# EAGLE design daGloane (EAGLE 6.1)
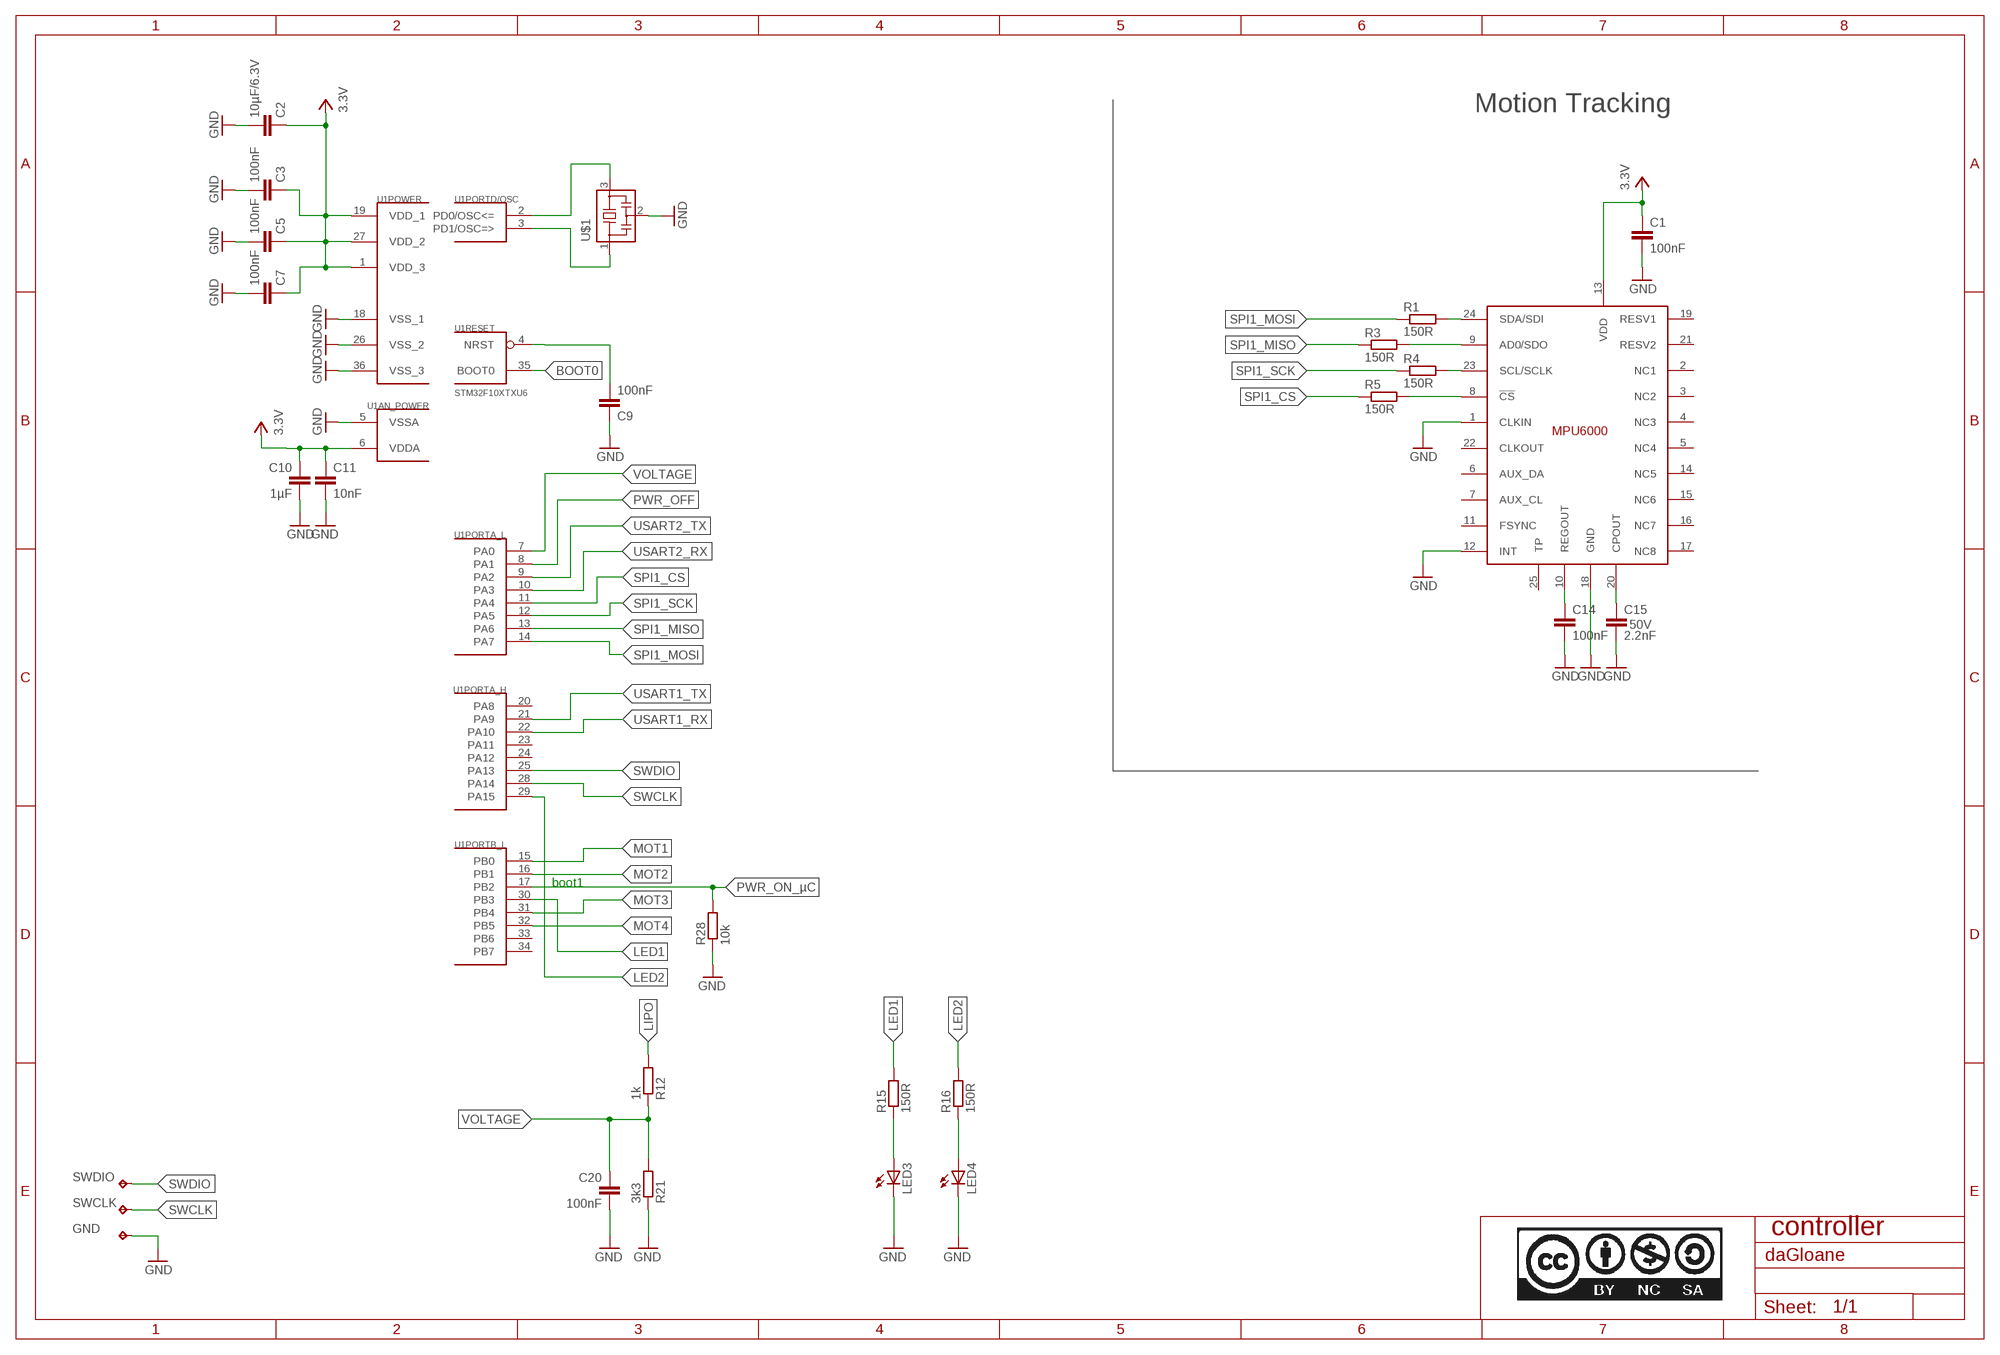
[diagram p0: schematic, sheet 1, part 1 of 3]
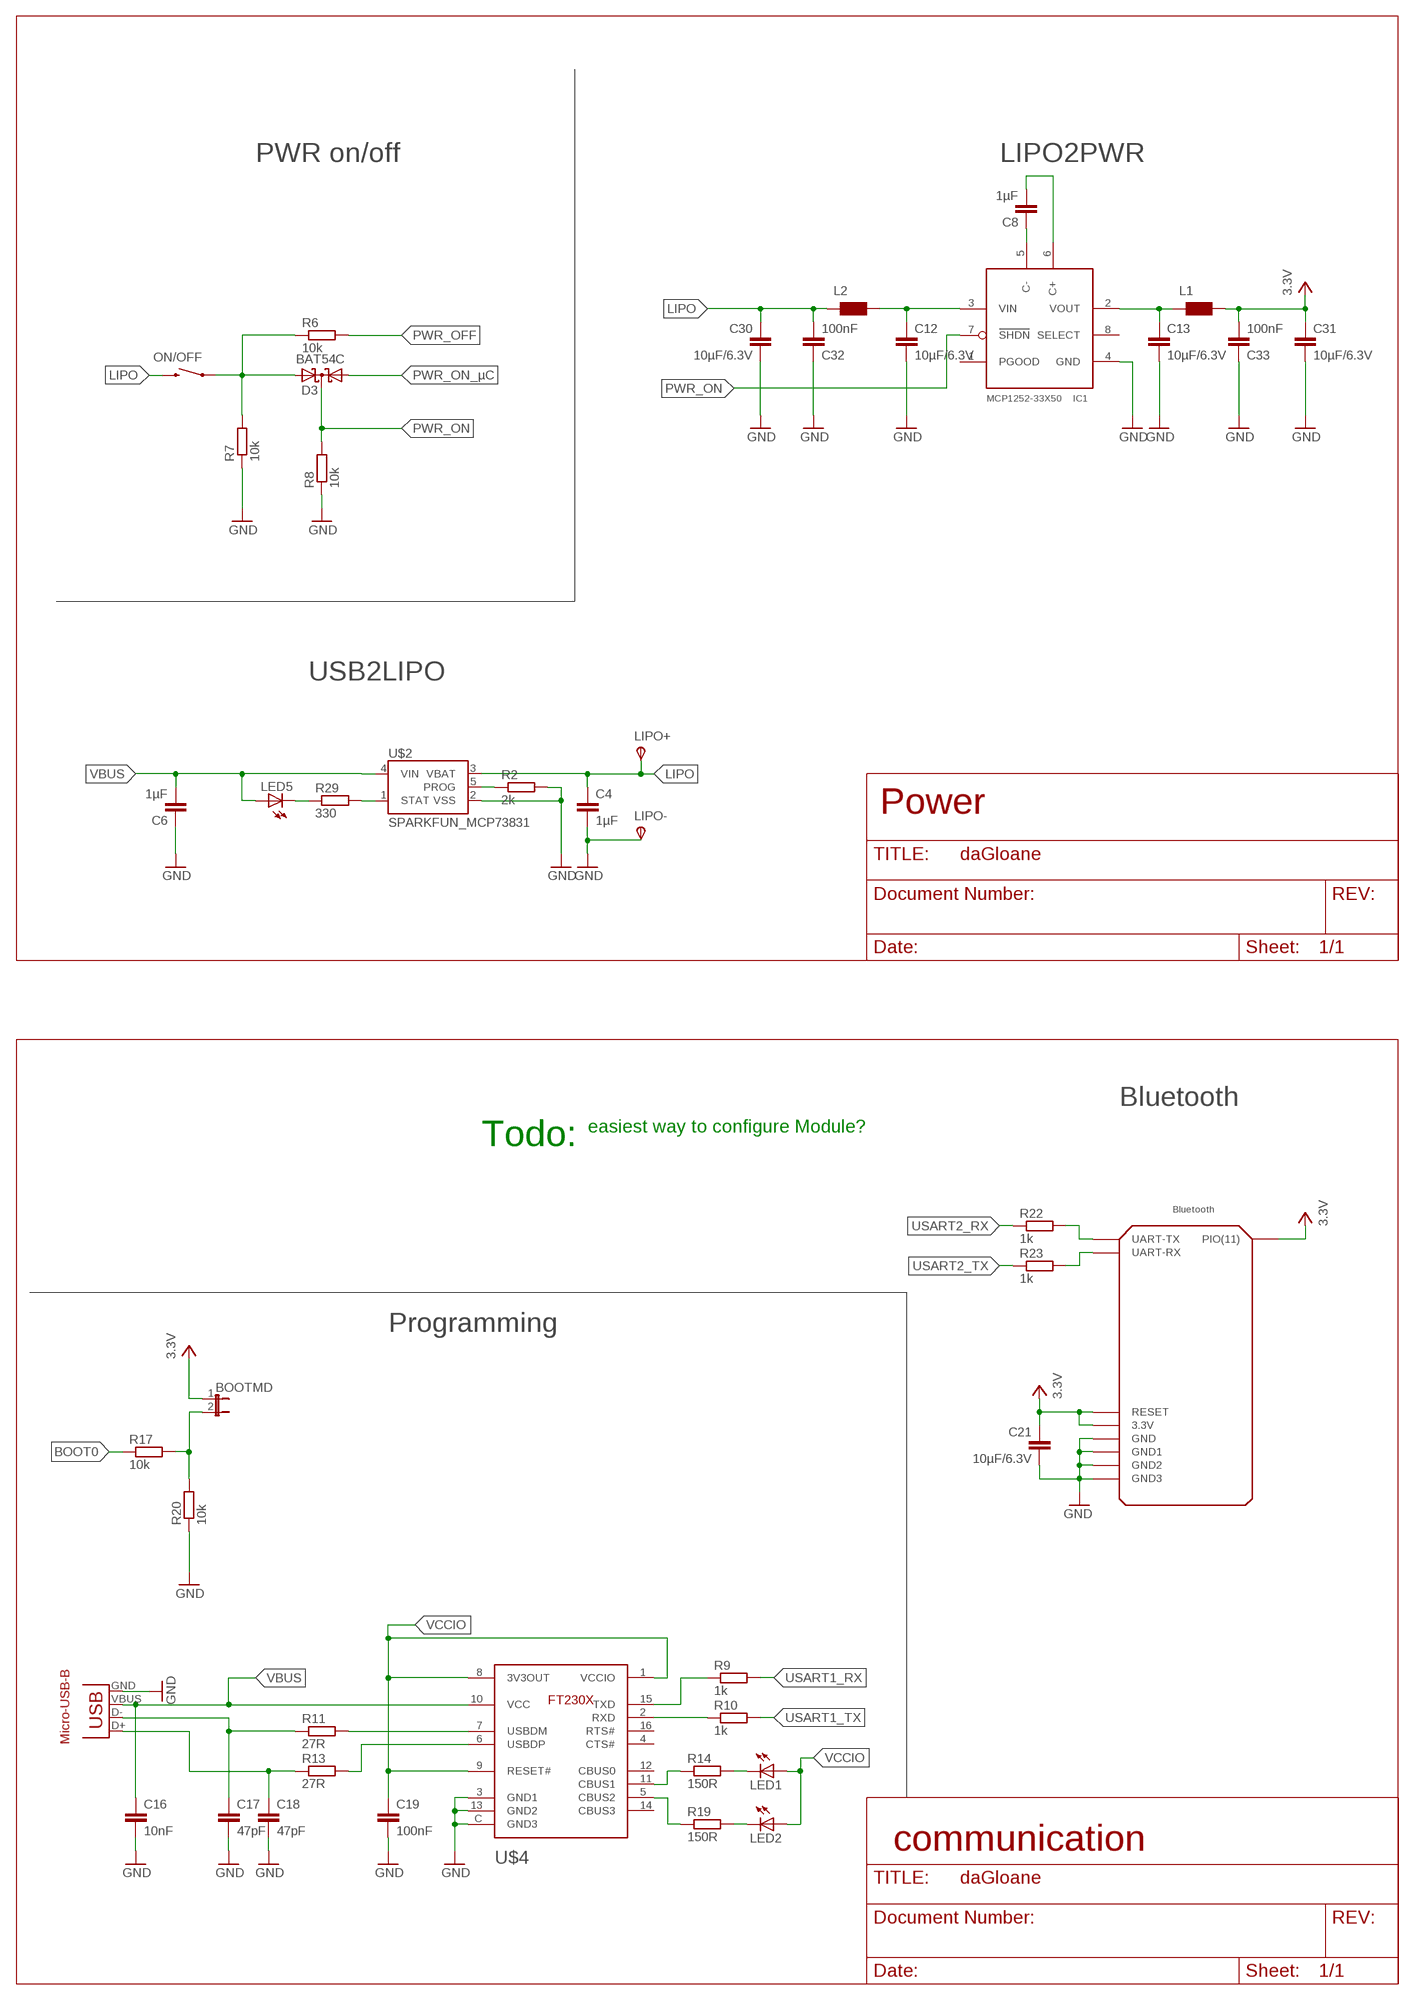
[diagram p1: schematic, sheet 1, part 2 of 3]
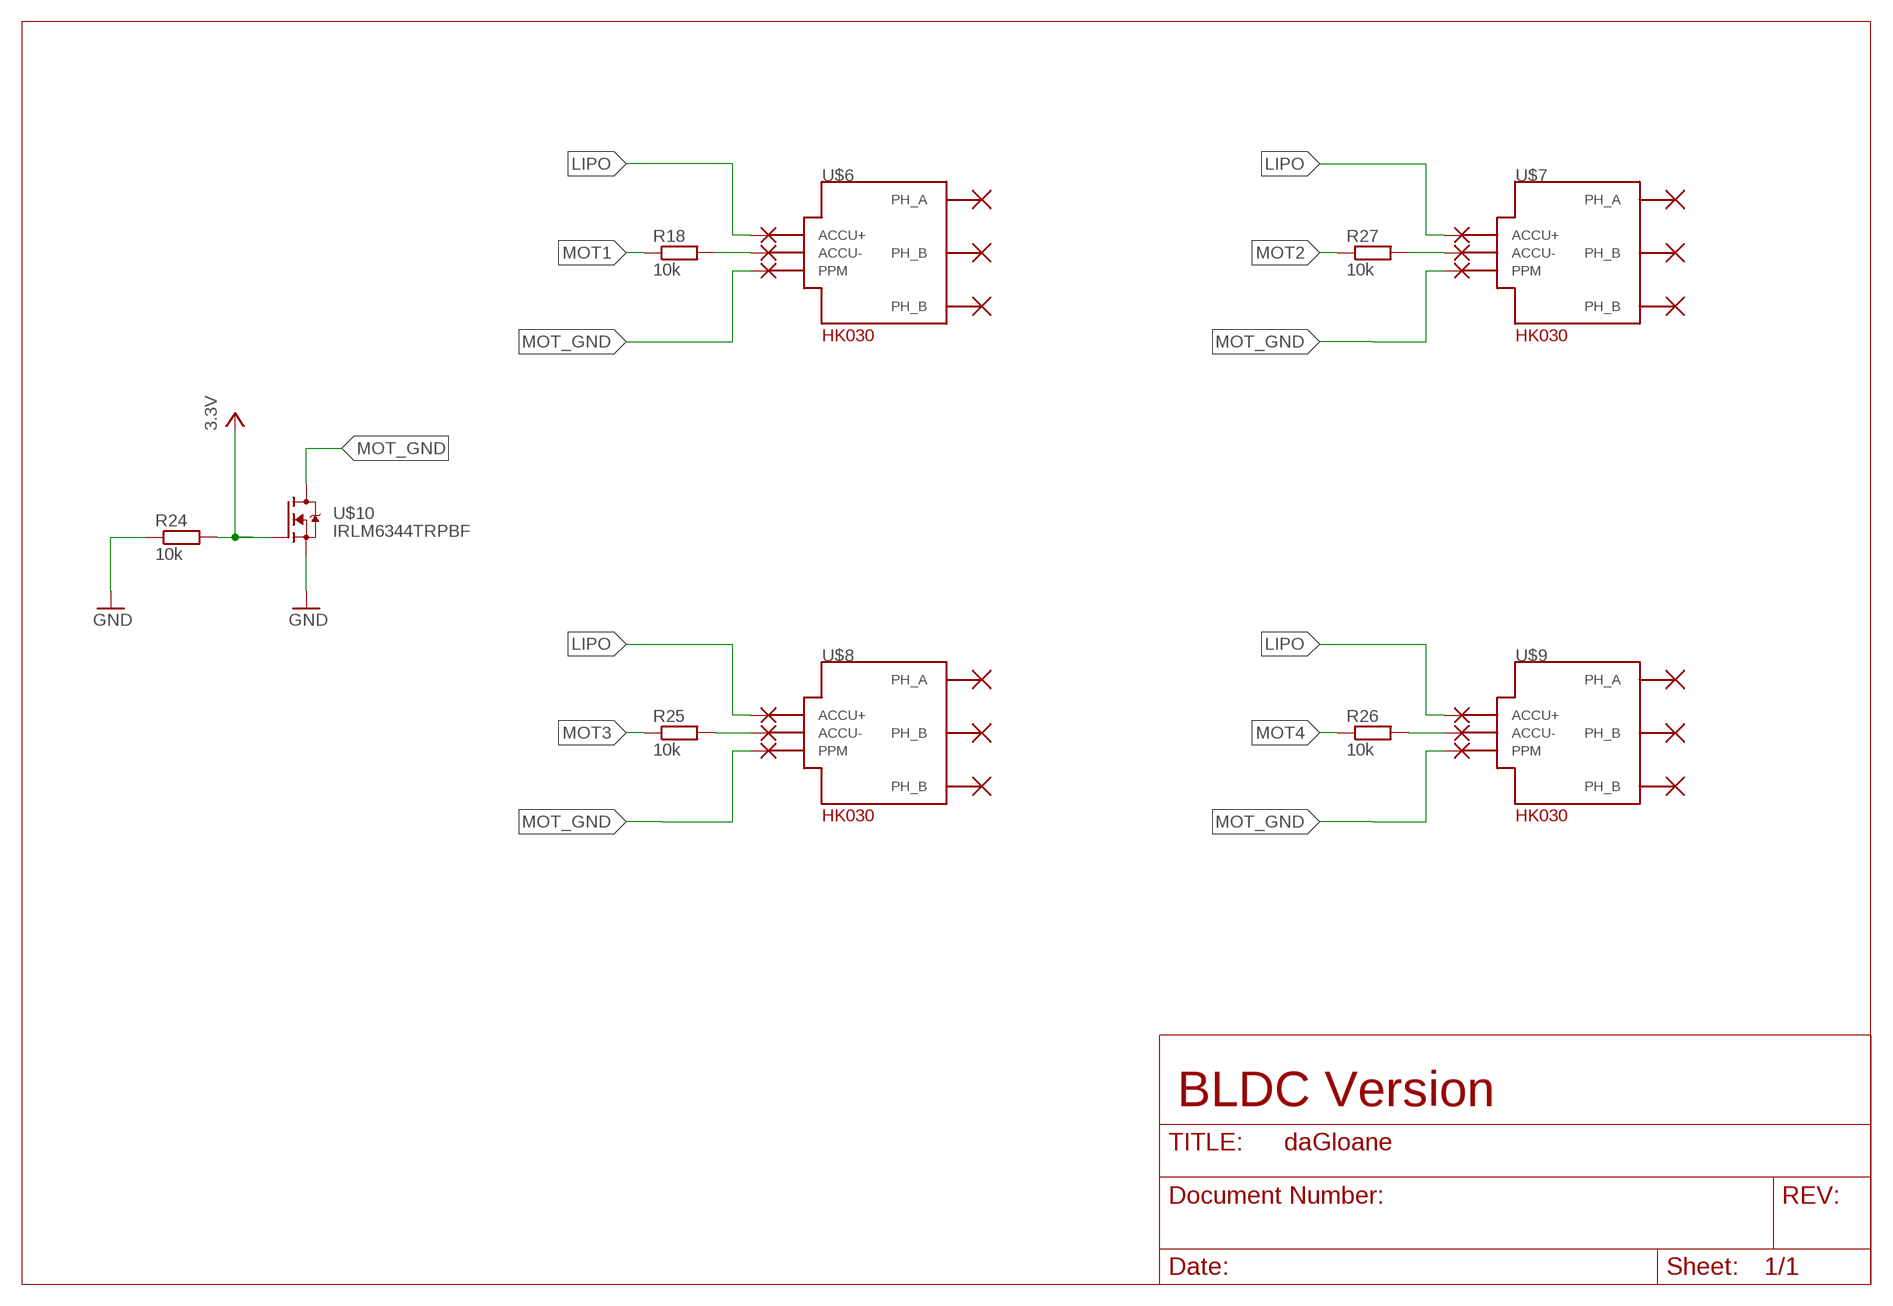
[diagram p2: schematic, sheet 1, part 3 of 3]

## Parts
BOOTMD  JUMPER-2  [1X02_50MIL]
C1  100nF  C-EUC0603  [C0603]
C2  10µF/6.3V  C-EUC0805  [C0805]
C3  100nF  C-EUC0603  [C0603]
C4  1µF  C-EUC0603  [C0603]
C5  100nF  C-EUC0603  [C0603]
C6  1µF  C-EUC0603  [C0603]
C7  100nF  C-EUC0603  [C0603]
C8  1µF  C-EUC0603  [C0603]
C9  100nF  C-EUC0603  [C0603]
C10  1µF  C-EUC0603  [C0603]
C11  10nF  C-EUC0603  [C0603]
C12  10µF/6.3V  C-EUC0805  [C0805]
C13  10µF/6.3V  C-EUC0805  [C0805]
C14  100nF  C-EUC0603  [C0603]
C15  2.2nF  C-EUC0603  [C0603]
C16  10nF  C-EUC0603  [C0603]
C17  47pF  C-EUC0603  [C0603]
C18  47pF  C-EUC0603  [C0603]
C19  100nF  C-EUC0603  [C0603]
C20  100nF  C-EUC0603  [C0603]
C21  10µF/6.3V  C-EUC0805  [C0805]
C30  10µF/6.3V  C-EUC0805  [C0805]
C31  10µF/6.3V  C-EUC0805  [C0805]
C32  100nF  C-EUC0603  [C0603]
C33  100nF  C-EUC0603  [C0603]
D3  BAT54C  [SOT23]
GND  TESTPAD_TPB1,27  [TESTPAD_B1,27]
IC1  MCP1252-33X50  [MSOP8]
L1  WUERTH-ELEKTRONIK_WE-KI_0805_B  [WUERTH-ELEKTRONIK_WE-KI_0805_B]
L2  WUERTH-ELEKTRONIK_WE-KI_0805_B  [WUERTH-ELEKTRONIK_WE-KI_0805_B]
LED1  LEDCHIPLED_0603  [CHIPLED_0603]
LED2  LEDCHIPLED_0603  [CHIPLED_0603]
LED3  LEDCHIPLED_0603  [CHIPLED_0603]
LED4  LEDCHIPLED_0603  [CHIPLED_0603]
LED5  LEDCHIPLED_0603  [CHIPLED_0603]
LIPO+  TPSPAD1-13  [P1-13]
LIPO-  TPSPAD1-13  [P1-13]
ON/OFF  SWITCH-MOMENTARY-2SMD  [TACTILE_SWITCH_SMD]
PAD1  SMD2  [SMD1,27-2,54]
PAD2  SMD2  [SMD1,27-2,54]
PAD3  SMD2  [SMD1,27-2,54]
PAD4  SMD2  [SMD1,27-2,54]
PAD5  SMD2  [SMD1,27-2,54]
PAD6  SMD2  [SMD1,27-2,54]
PAD7  SMD2  [SMD1,27-2,54]
PAD8  SMD2  [SMD1,27-2,54]
PAD9  SMD2  [SMD1,27-2,54]
PAD10  SMD2  [SMD1,27-2,54]
PAD11  SMD2  [SMD1,27-2,54]
PAD12  SMD2  [SMD1,27-2,54]
R1  150R  R-EU_R0603  [R0603]
R2  2k  R-EU_R0603  [R0603]
R3  150R  R-EU_R0603  [R0603]
R4  150R  R-EU_R0603  [R0603]
R5  150R  R-EU_R0603  [R0603]
R6  10k  R-EU_R0603  [R0603]
R7  10k  R-EU_R0603  [R0603]
R8  10k  R-EU_R0603  [R0603]
R9  1k  R-EU_R0603  [R0603]
R10  1k  R-EU_R0603  [R0603]
R11  27R  R-EU_R0603  [R0603]
R12  1k  R-EU_R0603  [R0603]
R13  27R  R-EU_R0603  [R0603]
R14  150R  R-EU_R0603  [R0603]
R15  150R  R-EU_R0603  [R0603]
R16  150R  R-EU_R0603  [R0603]
R17  10k  R-EU_R0603  [R0603]
R18  10k  R-EU_R0603  [R0603]
R19  150R  R-EU_R0603  [R0603]
R20  10k  R-EU_R0603  [R0603]
R21  3k3  R-EU_R0603  [R0603]
R22  1k  R-EU_R0603  [R0603]
R23  1k  R-EU_R0603  [R0603]
R24  10k  R-EU_R0603  [R0603]
R25  10k  R-EU_R0603  [R0603]
R26  10k  R-EU_R0603  [R0603]
R27  10k  R-EU_R0603  [R0603]
R28  10k  R-EU_R0603  [R0603]
R29  330  R-EU_R0603  [R0603]
SWCLK  TESTPAD_TPB1,27  [TESTPAD_B1,27]
SWDIO  TESTPAD_TPB1,27  [TESTPAD_B1,27]
U1  STM32F10XTXU6  [VFQFPN36]
U$1  MURATA-FILTER_CSTCE__G  [MURATA-FILTER_CSTCE__G]
U$2  SPARKFUN_MCP73831  [SPARKFUN_SOT23-5]
U$3  MPU6000  [MPU6000]
U$4  SERIAL_FT230XQ  [SERIAL_QFN4X4-16]
U$5  BLUETOOTH_REDUCED  [BLUETOOTH_REDUCED]
U$10  IRLM6344TRPBF  [MICRO3(SOT-23)]
X2  SPARKFUN-CONNECTORS_USB-MICROB  [SPARKFUN-CONNECTORS_USB-MICROB]

## Nets
BOOT0: R17.1 U1.35(RESET:BOOT0)
D+: C18.1 R13.1 X2.D+
D-: C17.1 R11.1 X2.D-
GND: C1.2 C2.2 C3.2 C4.2 C5.2 C6.1 C7.2 C9.1 C10.2 C11.2 C12.2 C13.2 C14.2 C15.2 C16.2 C17.2 C18.2 C19.2 C20.2 C21.2 C30.2 C31.2 C32.1 C33.1 GND.PP(TP) IC1.4(GND) LED3.C LED4.C LIPO-.TP(PP) R2.2 R7.1 R8.1 R20.1 R21.1 R24.1 R28.1 U1.5(AN_POWER:VSSA) U1.18(POWER:VSS_1) U1.26(POWER:VSS_2) U1.36(POWER:VSS_3) U$1.2 U$2.2(VSS) U$3.1(CLKIN) U$3.12(INT) U$3.18(GND) U$4.3(GND1) U$4.13(GND2) U$4.C(GND3) U$5.P$13(GND) U$5.P$14(GND1) U$5.P$21(GND2) U$5.P$22(GND3) U$10.2(S) X2.GND
LED1: R15.2 U1.30(PORTB_L:PB3)
LED2: R16.2 U1.29(PORTA_H:PA15)
LIPO: C4.1 C30.1 C32.2 L2.2 LIPO+.TP(PP) ON/OFF.3 PAD1.1(P) PAD4.1(P) PAD7.1(P) PAD10.1(P) R12.2 U$2.3(VBAT)
MOT1: R18.1 U1.15(PORTB_L:PB0)
MOT2: R27.1 U1.16(PORTB_L:PB1)
MOT3: R25.1 U1.31(PORTB_L:PB4)
MOT4: R26.1 U1.32(PORTB_L:PB5)
MOT_GND: PAD3.1(P) PAD6.1(P) PAD9.1(P) PAD12.1(P) U$10.3(D)
N$1: LED2.C R19.2
N$2: U1.2(PORTD/OSC:PD0/OSC<=) U$1.3
N$3: R2.1 U$2.5(PROG)
N$4: R5.2 U$3.8(!CS)
N$5: C15.1 U$3.20(CPOUT)
N$6: C14.1 U$3.10(REGOUT)
N$7: R22.2 U$5.P$1(UART-TX)
N$8: LED3.A R15.1
N$9: LED4.A R16.1
N$10: BOOTMD.2 R17.2 R20.2
N$11: R14.1 U$4.11(CBUS1)
N$12: R19.1 U$4.5(CBUS2)
N$13: R4.2 U$3.23(SCL/SCLK)
N$14: LED1.C R14.2
N$15: R23.2 U$5.P$2(UART-RX)
N$16: R11.2 U$4.7(USBDM)
N$17: R13.2 U$4.6(USBDP)
N$18: R3.2 U$3.9(AD0/SDO)
N$19: R1.2 U$3.24(SDA/SDI)
N$20: R9.1 U$4.15(TXD)
N$21: R10.1 U$4.2(RXD)
N$22: PAD2.1(P) R18.2
N$23: D3.2(A2) ON/OFF.1 R6.1 R7.2
N$24: C8.2 IC1.6(C+)
N$25: U1.3(PORTD/OSC:PD1/OSC=>) U$1.1
N$28: C8.1 IC1.5(C-)
N$39: PAD11.1(P) R27.2
N$40: PAD5.1(P) R25.2
N$41: PAD8.1(P) R26.2
N$43: R29.2 U$2.1(STAT)
N$44: LED5.C R29.1
N$45: C12.1 IC1.3(VIN) L2.1
N$46: C13.1 IC1.2(VOUT) L1.2
PWR_OFF: R6.2 U1.8(PORTA_L:PA1)
PWR_ON: D3.3(CC) IC1.7(SHDN) R8.2
PWR_ON_µC: D3.1(A1) R28.2 U1.17(PORTB_L:PB2)
RESET1: C9.2 U1.4(RESET:NRST)
SPI1_CS: R5.1 U1.11(PORTA_L:PA4)
SPI1_MISO: R3.1 U1.13(PORTA_L:PA6)
SPI1_MOSI: R1.1 U1.14(PORTA_L:PA7)
SPI1_SCK: R4.1 U1.12(PORTA_L:PA5)
SWCLK: SWCLK.PP(TP) U1.28(PORTA_H:PA14)
SWDIO: SWDIO.PP(TP) U1.25(PORTA_H:PA13)
USART1_RX: R9.2 U1.22(PORTA_H:PA10)
USART1_TX: R10.2 U1.21(PORTA_H:PA9)
USART2_RX: R22.1 U1.10(PORTA_L:PA3)
USART2_TX: R23.1 U1.9(PORTA_L:PA2)
VBUS: C6.2 C16.1 LED5.A U$2.4(VIN) U$4.10(VCC) X2.VBUS
VCC: BOOTMD.1 C1.1 C2.1 C3.1 C5.1 C7.1 C10.1 C11.1 C21.1 C31.1 C33.2 L1.1 R24.2 U1.1(POWER:VDD_3) U1.6(AN_POWER:VDDA) U1.19(POWER:VDD_1) U1.27(POWER:VDD_2) U$3.13(VDD) U$5.P$11(RESET) U$5.P$12(3.3V) U$5.P$34(PIO(11)) U$10.1(G) ; supply symbol labelled 3.3V
VCCIO: C19.1 LED1.A LED2.A U$4.1(VCCIO) U$4.8(3V3OUT) U$4.9(RESET#)
VOLTAGE: C20.1 R12.1 R21.2 U1.7(PORTA_L:PA0)
Unconnected: IC1.1(PGOOD) IC1.8(SELECT) U1.20(PORTA_H:PA8) U1.23(PORTA_H:PA11) U1.24(PORTA_H:PA12) U1.33(PORTB_L:PB6) U1.34(PORTB_L:PB7) U$3.2(NC1) U$3.3(NC2) U$3.4(NC3) U$3.5(NC4) U$3.6(AUX_DA) U$3.7(AUX_CL) U$3.11(FSYNC) U$3.14(NC5) U$3.15(NC6) U$3.16(NC7) U$3.17(NC8) U$3.19(RESV1) U$3.21(RESV2) U$3.22(CLKOUT) U$3.25(TP) U$4.4(CTS#) U$4.12(CBUS0) U$4.14(CBUS3) U$4.16(RTS#)

## Notes on the sheet
- Motion Tracking
- boot1
- controller
- PWR on/off | LIPO2PWR
- USB2LIPO
- Power
- BLDC Version
- Bluetooth
- easiest way to configure Module?
- Todo:
- Programming
- FT230X
- Micro-USB-B
- communication

## Library data of the parts
BOOTMD = daGloane:JUMPER-2: Jumper Basic 0.1" spaced jumper. Use with breakaway headers.
C1-C14 C16-C21 C30-C33 = rcl:C-EU: CAPACITOR, European symbol
C15 = rcl:C-EU: CAPACITOR, European symbol; VOLTAGE: 50V
D3 = diode:BAT54C: Schottky Diodes Source: Fairchild .. BAT54.pdf
GND SWCLK SWDIO = daGloane:TESTPAD_TP: Test pad
IC1 = daGloane:MCP1252-33X50: 650KHz 3.3V / 5.0V Selectable Switching Regulator
L1 L2 = daGloane:WUERTH-ELEKTRONIK_WE-KI: SMD Wire Wound Ceramic Inductor WE-KI - Wire wound - High thermal stability - Rated current up to 1 A - High Q-factor - High SRF -- Especially developed for high frequency applications -- Perfect for applications in telecommunications -- Bluetooth -- Wireless LAN
LED1-LED5 = led:LED: LED OSRAM: - CHIPLED LG R971, LG N971, LY N971, LG Q971, LY Q971, LO R971, LY R971 LH N974, LH R974 LS Q976, LO Q976, LY Q976 LO Q996 - Hyper CHIPLED LW Q18S LB Q993, LB Q99A, LB R99A - SideLED LS A670, LO A670, LY A670, LG A670, LP A670 LB A673, LV A673, LT A673, LW A673 LH A674 LY A675 LS A676, LA A676, LO A676, LY A676, LW A676 LS A679, LY A679, LG A679 - Hyper Micro SIDELED® LS Y876, LA Y876, LO Y876, LY Y876 LT Y87S - SmartLED LW L88C, LW L88S LB L89C, LB L89S, LG L890 LS L89K, LO L89K, LY L89K LS L896, LA L896, LO L896, LY L896 - TOPLED LS T670, LO T670, LY T670, LG T670, LP T670 LSG T670, LSP T670, LSY T670, LOP T670, LYG T670 LG T671, LOG T671, LSG T671 LB T673, LV T673, LT T673, LW T673 LH T674 LS T676, LA T676, LO T676, LY T676, LB T676, LH T676, LSB T676, LW T676 LB T67C, LV T67C, LT T67C, LS T67K, LO T67K, LY T67K, LW E67C LS E67B, LA E67B, LO E67B, LY E67B, LB E67C, LV E67C, LT E67C LW T67C LS T679, LY T679, LG T679 LS T770, LO T770, LY T770, LG T770, LP T770 LB T773, LV T773, LT T773, LW T773 LH T774 LS E675, LA E675, LY E675, LS T675 LS T776, LA T776, LO T776, LY T776, LB T776 LHGB T686 LT T68C, LB T68C - Hyper Mini TOPLED® LB M676 - Mini TOPLED Santana® LG M470 LS M47K, LO M47K, LY M47K Source: http://www.osram.convergy.de LUXEON: - LUMILED® LXK2-PW12-R00, LXK2-PW12-S00, LXK2-PW14-U00, LXK2-PW14-V00 LXK2-PM12-R00, LXK2-PM12-S00, LXK2-PM14-U00 LXK2-PE12-Q00, LXK2-PE12-R00, LXK2-PE12-S00, LXK2-PE14-T00, LXK2-PE14-U00 LXK2-PB12-K00, LXK2-PB12-L00, LXK2-PB12-M00, LXK2-PB14-N00, LXK2-PB14-P00, LXK2-PB14-Q00 LXK2-PR12-L00, LXK2-PR12-M00, LXK2-PR14-Q00, LXK2-PR14-R00 LXK2-PD12-Q00, LXK2-PD12-R00, LXK2-PD12-S00 LXK2-PH12-R00, LXK2-PH12-S00 LXK2-PL12-P00, LXK2-PL12-Q00, LXK2-PL12-R00 Source: www.luxeon.com KINGBRIGHT: KA-3528ASYC Source: www.kingbright.com
LIPO+ LIPO- = testpad:TPS: TEST PIN
ON/OFF = daGloane:SWITCH-MOMENTARY-2: Various NO switches- pushbuttons, reed, etc
PAD1-PAD12 = daGloane:SMD2: SMD PAD
R1-R29 = rcl:R-EU_: RESISTOR, European symbol
U1 = daGloane:STM32F10XTXU6: STM32F101/103 36pad VFQPFN36
U$1 = daGloane:MURATA-FILTER_CSTCE__G
U$2 = daGloane:SPARKFUN_MCP73831: Microchip s MCP73831 Miniature single cell, fully integrated Li-Ion, Li-polymer charge management controller http://ww1.microchip.com/downloads/en/DeviceDoc/21984a.pdf'
U$3 = daGloane:MPU6000
U$4 = daGloane:SERIAL_FT230XQ
U$5 = daGloane:BLUETOOTH_REDUCED
U$10 = daGloane:IRLM6344TRPBF
X2 = daGloane:SPARKFUN-CONNECTORS_USB: USB Connectors USB-B-PTH is fully proven SKU : PRT-00139 USB-miniB is fully proven SKU : PRT-00587 USB-A-PCB is untested. USB-A-H is throughly reviewed, but untested. Spark Fun Electronics SKU : PRT-00437 USB-B-SMT is throughly reviewed, but untested. Needs silkscreen touching up. USB-A-S has not been used/tested USB-MB-H has not been used/tested

## Board
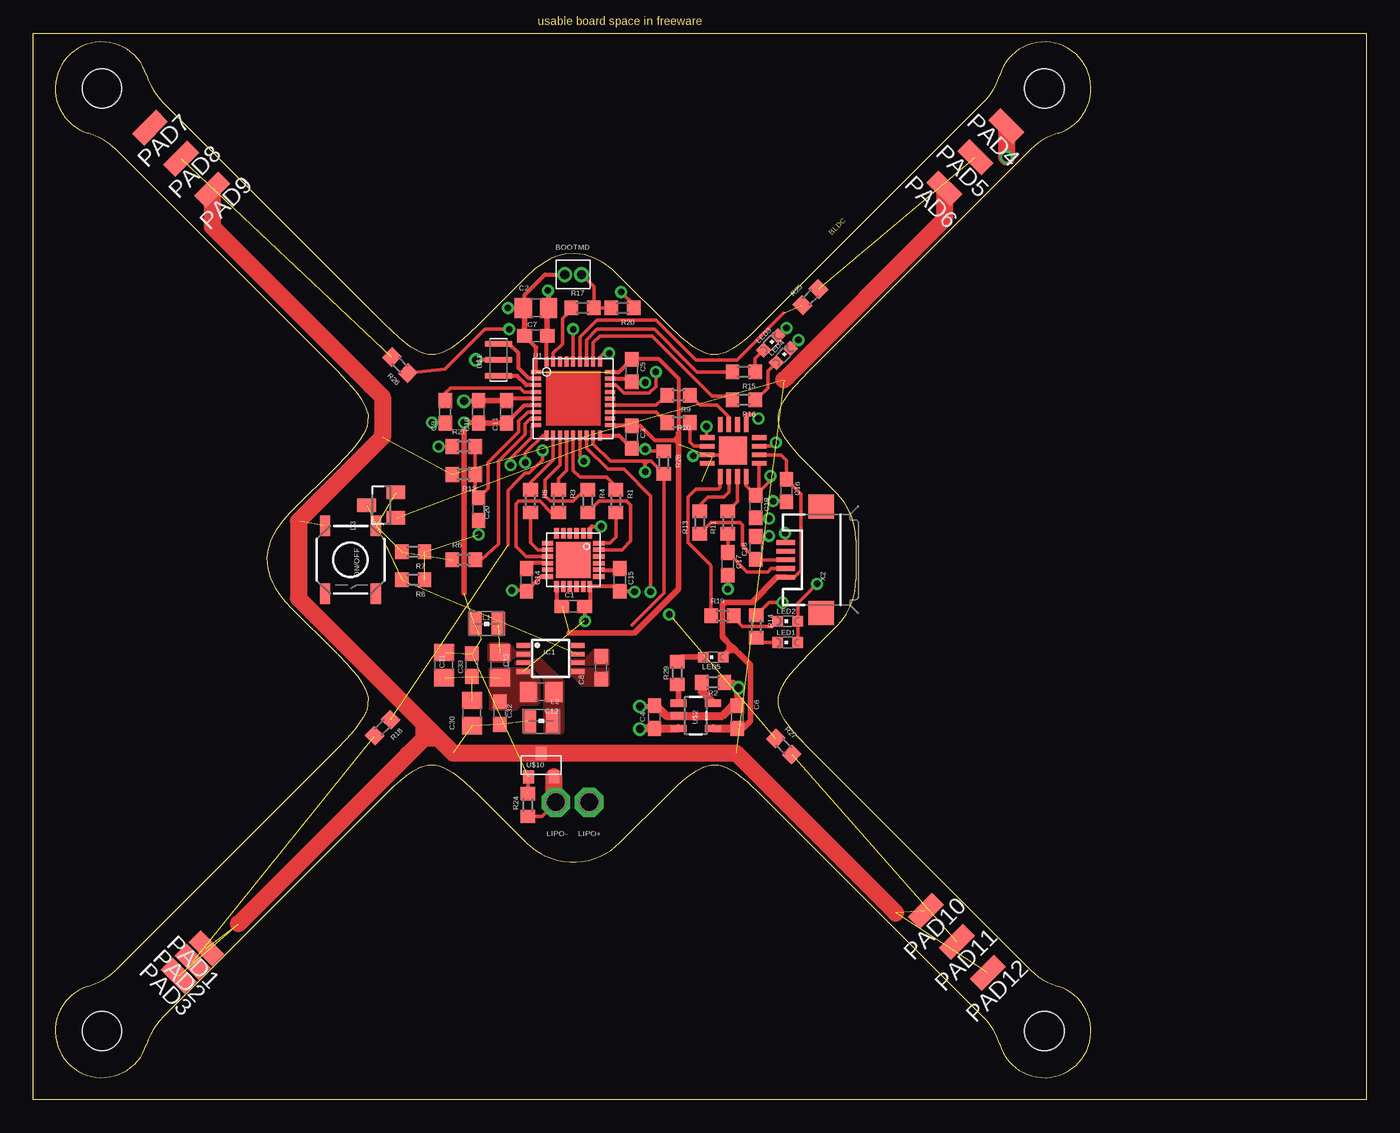
[diagram p3: board, top side]
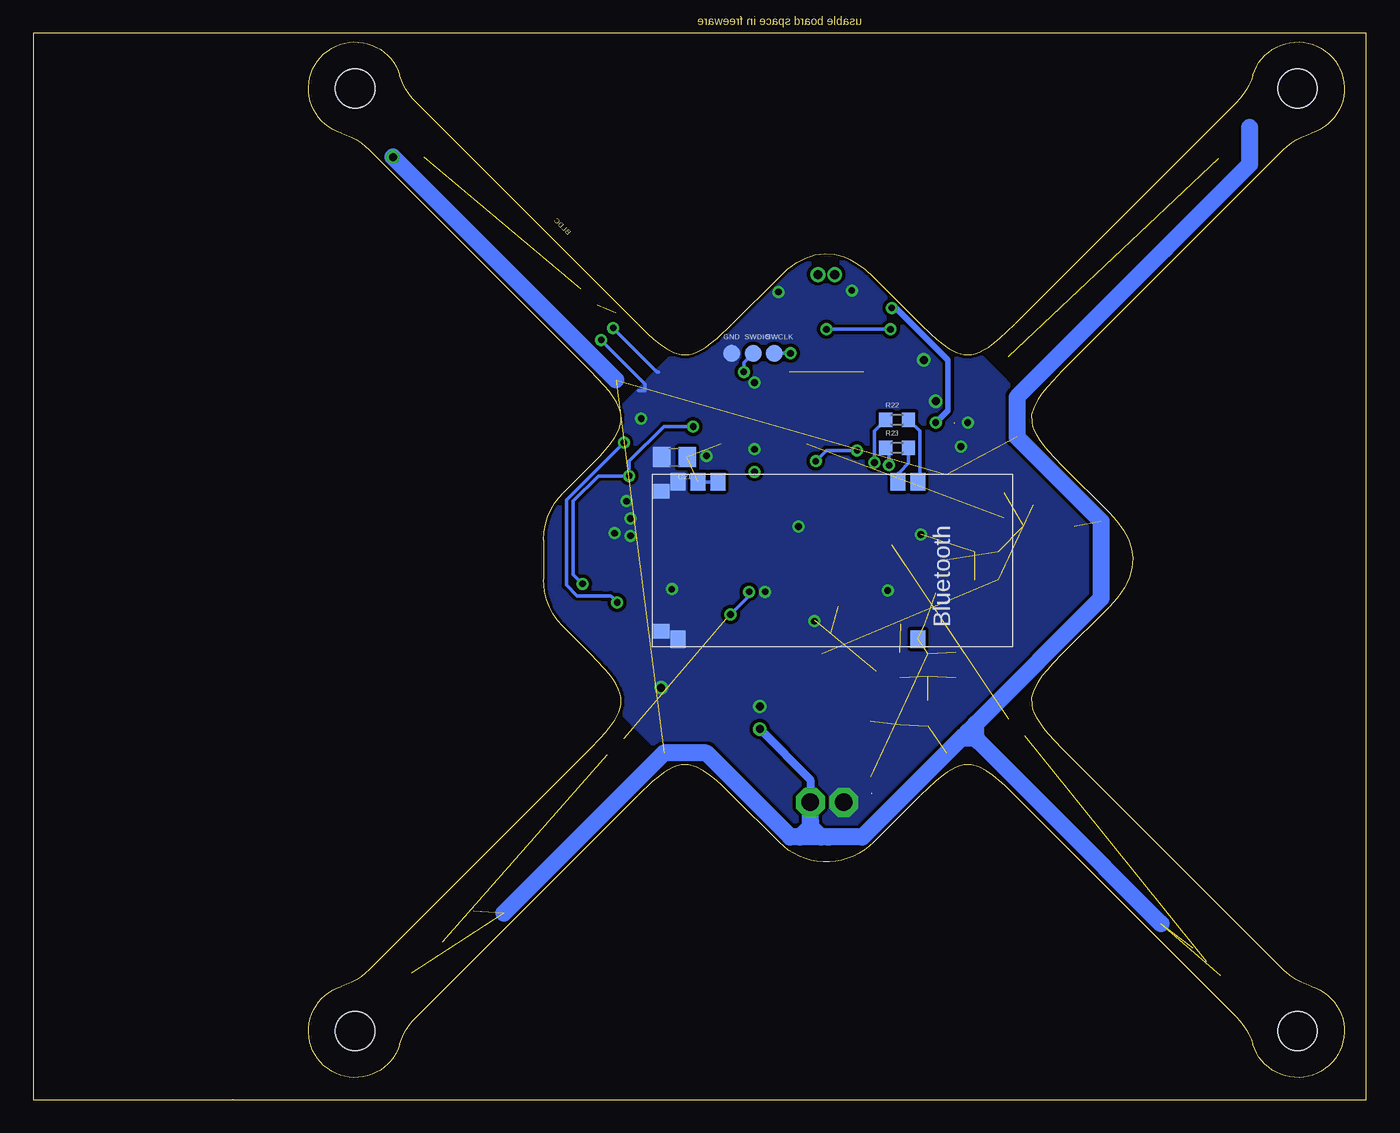
[diagram p4: board, bottom side, seen from below]

Size 100 x 80 mm. Coordinates in mm from the lower left corner, seen from the top.
Outline: 183 segments
Copper layers (1*16): Top 0.035mm / dielectric 1.5mm / Bottom 0.035mm
Design rules: minimum track width 0.15mm, minimum drill 0.3mm, track to track 0.15mm, track to pad 0.15mm, pad to pad 0.15mm, via to via 0.15mm, smd to smd 0mil, copper to edge 0.2mm, drill to drill 0.2mm, minimum pad ring 0.2mm, minimum via ring 0.2mm, stop-mask expansion 4mil, vias tented up to drill 0.8mm, thermal gap 0.15mm
Holes 2.95 mm at 5.14,5.14 75.86,5.14 75.86,75.86 5.14,75.86

### Footprints (pad centres in the part's own frame; a part is rotated, then mirrored left to right if it is on the bottom)
1X02_50MIL = drill 0.7 pad 1.1: 1 -0.635,0; 2 0.635,0
C0603 = smd 1.1 x 1: 1 -0.85,0; 2 0.85,0
C0805 = smd 1.3 x 1.5: 1 -0.95,0; 2 0.95,0
SOT23 = smd 1 x 1.4: 1 -0.95,-1.1; 2 0.95,-1.1; 3 0,1.1
TESTPAD_B1,27 = smd 1.27 x 1.27: PP 0,0
MSOP8 = smd 0.35 x 1: 1 -0.975,-2.05; 2 -0.325,-2.05; 3 0.325,-2.05; 4 0.975,-2.05; 5 0.975,2.05; 6 0.325,2.05; 7 -0.325,2.05; 8 -0.975,2.05
WUERTH-ELEKTRONIK_WE-KI_0805_B = smd 1.02 x 1.78: 1 -0.89,0; 2 0.89,0
CHIPLED_0603 = smd 0.8 x 0.8: A 0,-0.75; C 0,0.75
P1-13 = drill 1.321 pad 2.159 octagon: TP 0,0
TACTILE_SWITCH_SMD = smd 1.524 x 0.762: 1 -2.54,1.905; 2 2.54,1.905; 3 -2.54,-1.905; 4 2.54,-1.905
SMD1,27-2,54 = smd 1.27 x 2.54: 1 0,0
R0603 = smd 1 x 1.1: 1 -0.85,0; 2 0.85,0
VFQFPN36 = smd 0.75 x 0.3: 1 -2.775,2; 2 -2.775,1.5; 3 -2.775,1; 4 -2.775,0.5; 5 -2.775,0; 6 -2.775,-0.5; 7 -2.775,-1; 8 -2.775,-1.5; 9 -2.775,-2; 19 2.775,-2; 20 2.775,-1.5; 21 2.775,-1; 22 2.775,-0.5; 23 2.775,0; 24 2.775,0.5; 25 2.775,1; 26 2.775,1.5; 27 2.775,2 | smd 0.3 x 0.75: 10 -2,-2.775; 11 -1.5,-2.775; 12 -1,-2.775; 13 -0.5,-2.775; 14 0,-2.775; 15 0.5,-2.775; 16 1,-2.775; 17 1.5,-2.775; 18 2,-2.775; 28 2,2.775; 29 1.5,2.775; 30 1,2.775; 31 0.5,2.775; 32 0,2.775; 33 -0.5,2.775; 34 -1,2.775; 35 -1.5,2.775; 36 -2,2.775
MURATA-FILTER_CSTCE__G = smd 0.4 x 2: 1 -1.2,0; 2 0,0; 3 1.2,0
SPARKFUN_SOT23-5 = smd 0.55 x 1.2: 1 -0.95,-1.3; 2 0,-1.3; 3 0.95,-1.3; 4 0.95,1.3; 5 -0.95,1.3
MPU6000 = smd 0.8 x 0.35: 1 -2,1.25; 2 -2,0.75; 3 -2,0.25; 4 -2,-0.25; 5 -2,-0.75; 6 -2,-1.25; 13 2,-1.25; 14 2,-0.75; 15 2,-0.25; 16 2,0.25; 17 2,0.75; 18 2,1.25 | smd 0.35 x 0.85: 7 -1.25,-1.925; 8 -0.75,-1.925; 9 -0.25,-1.925; 10 0.25,-1.925; 11 0.75,-1.925; 12 1.25,-1.925; 19 1.25,1.925; 20 0.75,1.925; 21 0.25,1.925; 22 -0.25,1.925; 23 -0.75,1.925; 24 -1.25,1.925 | smd 2.7 x 2.6: 25 0,0
SERIAL_QFN4X4-16 = smd 1.1 x 0.35: 1 -1.95,0.975; 2 -1.95,0.325; 3 -1.95,-0.325; 4 -1.95,-0.975; 9 1.95,-0.975; 10 1.95,-0.325; 11 1.95,0.325; 12 1.95,0.975 | smd 0.35 x 1.1: 5 -0.975,-1.95; 6 -0.325,-1.95; 7 0.325,-1.95; 8 0.975,-1.95; 13 0.975,1.95; 14 0.325,1.95; 15 -0.325,1.95; 16 -0.975,1.95 | smd 2.1 x 2.1: C 0,0
BLUETOOTH_REDUCED = smd 1.3 x 1.1: P$1 -5.75,6.87; P$2 -5.75,5.37; P$11 -5.75,-8.13; P$12 -5.75,-9.63; P$13 -5.75,-11.13; P$22 6.05,-11.13; P$34 6.05,6.87 | smd 1.1 x 1.3: P$14 -5.05,-12.43; P$21 5.45,-12.43
MICRO3(SOT-23) = smd 0.802 x 0.972: 1 -0.95,-0.885; 2 0.95,-0.885; 3 0,0.885
SPARKFUN-CONNECTORS_USB-MICROB = smd 0.35 x 1.4: D+ 0,2.65; D- -0.65,2.65; GND 1.3,2.65; ID 0.65,2.65; VBUS -1.3,2.65 | smd 1.8 x 1.9: MT1 -4,0; MT2 4,0

### Placement (x,y rotation side)
BOOTMD  40.5,61.9 0 top
C1  40.5,37 0 top
C2  37.7,59.4 0 top
C3  44.9,49.7 270 top
C4  46.6,28.7 90 top
C5  44.9,54.7 270 top
C6  52.8,28.7 270 top
C7  37.7,57.3 0 top
C8  42.6,32.4 90 top
C9  30.9,51.6 90 top
C10  33.4,51.6 90 top
C11  35.5,51.6 90 top
C12  38.1,30.6 180 top
C13  35,32.6 270 top
C14  37,39 270 top
C15  44,39 270 top
C16  56.5,45.7 270 top
C17  52.1,40.2 270 top
C18  54.2,41.4 90 top
C19  54.2,44.5 270 top
C20  33.4,44.3 270 top
C21  51.9,48.2 180 bottom
C30  32.9,29 90 top
C31  30.8,32.6 270 top
C32  35,29 270 top
C33  32.9,32.6 90 top
D3  26.1,44.6 90 top
GND  47.6,56 0 bottom
IC1  38.8,33.1 270 top
L1  34,35.7 0 top
L2  38.1,28.4 180 top
LED1  56.6,34.3 90 top
LED2  56.6,35.9 90 top
LED3  55.33,56.77 315 top
LED4  56.27,55.83 315 top
LED5  51,33.2 90 top
LIPO+  41.7,22.3 180 top
LIPO-  39.2,22.3 180 top
ON/OFF  23.8,40.5 270 top
PAD1  12.99,11.36 45 top
PAD2  11.95,10.32 45 top
PAD3  10.92,9.29 45 top
PAD4  73.02,73.03 45 top
PAD5  70.68,70.69 45 top
PAD6  68.35,68.36 45 top
PAD7  8.75,72.93 135 top
PAD8  11.09,70.6 135 top
PAD9  13.42,68.27 135 top
PAD10  66.96,14.16 135 top
PAD11  69.29,11.83 135 top
PAD12  71.63,9.5 135 top
R1  43.7,44.9 270 top
R2  51,31.3 0 top
R3  39.4,44.9 270 top
R4  41.6,44.9 270 top
R5  37.3,44.9 270 top
R6  32.3,40.5 0 top
R7  28.5,41.1 180 top
R8  28.5,39 180 top
R9  48.4,52.85 180 top
R10  48.4,50.8 180 top
R11  52.1,43.3 90 top
R12  32.3,46.9 180 top
R13  50,43.3 90 top
R14  54.23,35.49 270 top
R15  53.3,54.6 180 top
R16  53.3,52.5 180 top
R17  41.2,59.4 0 top
R18  26.2,27.9 225 top
R19  51.7,36.3 0 top
R20  44.2,59.4 180 top
R21  32.3,49 0 top
R22  35.2,51 0 bottom
R23  35.2,48.9 0 bottom
R24  37.1,22.1 90 top
R25  58.3,60.2 45 top
R26  27.5,55.1 135 top
R27  56.3,26.5 315 top
R28  47.3,47.8 270 top
R29  48.3,32 270 top
SWCLK  44.4,56 0 bottom
SWDIO  46,56 0 bottom
U1  40.5,52.6 0 top
U$1  34.9,55.5 90 top
U$2  49.7,28.8 270 top
U$3  40.5,40.5 270 top
U$4  52.5,48.7 0 top
U$5  40.5,40.6 270 bottom
U$10  38.1,25.1 0 top
X2  59.1,40.5 90 top

### Tracks (layer width: path | path; a pad name or v marks a point on that pad's centre or on a via)
BOOT0
  Top 0.254: U1.35 39,56 39.7,56.7 39.7,58.6 40.35,59.25 R17.1
D+
  Top 0.254: X2.D+ 54.25,40.5 C18.1 53.2,41.55 53.2,43.1 53,43.3 52.9,43.3 50.85,43.3 R13.1
D-
  Top 0.2: 56.5,39.9 X2.D-
  Top 0.254: X2.D- 55.35,39.85 55.1,39.6 53.55,39.6 C17.1 R11.1
GND  (via drill 0.5, 0.6)  (7 unrouted)
  Top 0.254: R20.1 45.05,59.65 v44.1,60.6 | C5.2 44.95,53.8 v45.9,53.8 | U$4.C 52.17,48.38 U$4.3 49.58,48.38 v49.5,48.3 | 30.95,50.8 v29.9,50.8 | R28.1 46.05,48.65 v45.9,48.8 | v30.4,49 R21.1 | C20.2 v33.4,42.4 | LED3.C 55.9,57.3 v56.5,57.9 | LED4.C 56.8,56.4 v57.4,57 | U$4.13 53.48,51.4 54.1,51.4 v54.4,51.1 | X2.GND 56.45,42.45 v56.4,42.5 | C19.2 54.25,43.6 v55.2,43.6 | C18.2 54.25,42.3 v55.2,42.3 | C17.2 v52.1,38.3 | C16.2 56.45,44.9 v55.5,44.9 | R24.1 38.15,21.25 LIPO-.TP
  Top 0.305: U1.36 38.5,57.15 | U1.5 35.65,52.6 C11.2 | U$1.2 v33.2,55.5 | U1.18 43.92,49.83 C3.2 45.85,48.85 v45.9,48.8 | U$3.12 38.1,39.25 C14.2 36.95,38.2 v35.9,38.2 | v41.4,35.9 41.35,35.95 C1.2 41.75,37.4 U$3.18 43.65,38.5 C15.2 45.05,38.15 v45.1,38.1 | U$3.1 41.75,42.85 41.9,43 v42.6,43 | U1.26 44.65,54.1 C5.2
  Top 0.4: 46.75,29.55 46.7,29.5 v45.5,29.5
  Top 0.406: C4.2 46.75,29.55 | 52.45,29.55 C6.1 52.8,30.8 v52.9,30.9 52.5,31.3 R2.2 | 38.5,57.15 C7.2 38.55,59.3 C2.2 38.65,60.65 v38.6,60.7 | C11.2 C10.2 33.35,52.4 v32.3,52.4
  Top 0.61: 46.75,29.55 47.5,28.8 U$2.2 51.7,28.8 52.45,29.55
  Top 1.27: LIPO-.TP 39.05,22.45 U$10.2
  Bottom 0.254: v45.9,53.8 46.1,53.8 | v56.5,57.9 53.2,54.6 53.1,54.6 | v54.4,51.1 54.6,51.1 | 54.6,53.2 54.1,53.2 54.1,53.7 v57.4,57 | v55.2,43.6 55.2,43.8
  Bottom 0.305: v33.2,55.5 33.1,55.5 | v45.9,48.8 45.9,48.7 | v35.9,38.2 35.8,38.2 | v41.4,35.9 41.5,35.9 | v45.1,38.1 45.2,38 | v42.6,43 42.7,42.9
  Bottom 0.406: v38.6,60.7 38.6,60.8
  pour Top (no thermals): 34.3,32.3 37.1,32.3 37.9,31.5 37.9,29.8 37.8,29.7 36.6,29.7 36.2,29.3 34.3,29.3
  pour Bottom (isolate 0.254, no thermals): 13.75,40.5 40.5,13.75 67.25,40.5 40.5,67.25
LED1
  Top 0.254: U1.30 41.5,57 42.3,57.8 43.9,57.8 46.6,57.8 49.05,55.35 49.8,54.6 R15.2
LED2
  Top 0.254: U1.29 42,56.8 42.5,57.3 44,57.3 46.4,57.3 50.9,52.8 52.15,52.8 R16.2
LIPO  (via drill 0.6)  (9 unrouted)
  Top 0.6: C4.1 45.55,27.85 v45.5,27.8
  Top 0.61: C4.1 U$2.3
  Top 1.27: PAD4.1 v73.02,70.72
  Bottom 0.6: v45.5,27.8 41.7,24 LIPO+.TP
  Bottom 1.27: PAD7.1 8.75,70.15 15.1,63.8 26.2,52.7 26.2,49.7 19.9,43.4 19.9,37.6 29.3,28.2 | 29.3,28.2 29.9,27.6 | 29.9,27.6 30.4,27.1 | 30.4,27.1 31.5,26 37.8,19.7 40.3,19.7 | 40.3,19.7 40.4,19.7 | LIPO+.TP 41.7,21 41.7,20.7 | 29.9,27.6 29.8,27.6 29.1,26.9 | 29.1,26.9 23.9,21.7 15.4,13.2 | 29.1,26.9 29.3,27.1 | 29.3,27.1 29.3,28.2 | 29.1,26.9 29.3,27.1 | 29.3,27.1 30.4,27.1 | 40.3,19.7 40.9,19.7 | 40.9,19.7 42.5,19.7 | 42.5,19.7 43.2,19.7 47.3,23.8 49.5,26 52.6,26 52.7,26 64.7,14 | 41.7,20.7 41.7,20.5 | 41.7,20.5 42.5,19.7 | 41.7,20.7 41.7,20.5 | 41.7,20.5 40.9,19.7 | v73.02,70.72 56.3,54
MOT1  (via drill 0.5)  (1 unrouted)
  Top 0.254: U1.15 41,48.2 v41.3,47.9 | v38.2,48.7 38.2,48 37.2,47 36.9,47 36.3,46.4 35.6,45.7 35.6,41.6
  Bottom 0.254: v41.3,47.9 40.5,48.7 v38.2,48.7
MOT2  (via drill 0.5)  (1 unrouted)
  Top 0.254: U1.16 41.5,48.9 43.1,47.3 44.3,47.3 46.3,45.3 v46.3,38.1 | v47.7,36.4 48,36.1
  Bottom 0.254: v46.3,38.1 46.3,37.8 v47.7,36.4
MOT3  (1 unrouted)
  Top 0.254: U1.31 41,57.2 42.3,58.5 46.4,58.5 46.7,58.5 49.4,55.8 49.7,55.5 52.8,55.5 56.3,59
MOT4  (via drill 0.5)
  Top 0.254: v35.7,57.8 33.9,57.8 30.9,54.8 R26.1 | v40.5,57.8 40.5,57 U1.32
  Bottom 0.254: v40.5,57.8 40.3,57.8 v35.7,57.8
MOT_GND  (3 unrouted)
  Top 1.27: PAD9.1 13.42,65.48 25.3,53.6 26.2,52.7 26.2,50 26.2,49.7 19.9,43.4 19.9,37.6 26.8,30.7 29.3,28.2 | 29.3,28.2 30.5,27 30.7,26.8 31,26.5 31.05,26.45 31.52,25.99 U$10.3 38.12,26 51,26 52.7,26 64.7,14 | 15.4,13.2 28.1,25.9 29.3,27.1 | 29.3,27.1 29.3,28.2 | 30.4,27.1 29.3,27.1 | PAD6.1 68.35,66.05 56.3,54
N$1
  Top 0.254: LED2.C 55.45,35.5 54.3,35.5 53.3,35.5 | 53.3,35.5 53.2,35.5 | 53.2,35.5 52.6,36.1 52.55,36.15 R19.2 | 53.2,35.5 53.3,35.5
N$2
  Top 0.305: U1.2 37.2,54.1 36.4,54.9 36.4,56 35.7,56.7 U$1.3
N$3
  Top 0.61: R2.1 50.15,30.6 U$2.5
N$4
  Top 0.254: U$3.8 37.85,41.25 37.4,41.7 37.3,41.8 R5.2
N$5
  Top 0.305: U$3.20 43.9,39.75 C15.1
N$6
  Top 0.305: U$3.10 37.4,40.25 C14.1
N$7
  Bottom 0.254: R22.2 33.5,50.15 33.5,47.2 33.5,46.48 U$5.P$1
N$8
  Top 0.254: R15.1 54.15,55.59 LED3.A
N$9
  Top 0.254: R16.1 54.15,52.71 54.41,52.71 55.1,53.4 55.1,54.66 LED4.A
N$10
  Top 0.254: R20.2 R17.2 42.05,60.99 BOOTMD.2
N$11  (via drill 0.5)
  Top 0.254: U$4.11 55.42,49.03 v55.7,49.3 | R14.1 55.19,37.3 v56.2,37.3
  Bottom 0.254: v55.7,49.3 60,45 60,38.6 59.2,37.8 57.4,37.8 56.7,37.8 56.6,37.7 v56.2,37.3
N$12
  Top 0.254: U$4.5 51.52,45.93 51.4,45.8 49.7,45.8 49.1,45.2 49.1,41.8 49.4,41.5 50.75,40.15 50.85,40.05 R19.1
N$13
  Top 0.254: U$3.23 44.15,41.25 44.8,41.9 44.8,44.6 44.5,44.9 42.45,44.9 R4.2
N$14
  Top 0.254: LED1.C 54.57,34.3 R14.2
N$15
  Bottom 0.254: R23.2 34.35,47.75 35,47.1 35.13,46.97 U$5.P$2
N$16
  Top 0.254: U$4.7 52.83,44.88 R11.2
N$17
  Top 0.254: U$4.6 52.17,45.58 51.8,45.2 50.6,45.2 50.2,44.8 50,44.6 R13.2
N$18
  Top 0.254: U$3.9 36.95,40.75 36.2,41.5 36.2,44.7 36.4,44.9 38,44.9 38.85,44.05 R3.2
N$19
  Top 0.254: U$3.24 43.25,41.75 43.7,42.2 R1.2
N$20
  Top 0.254: U$4.15 52.17,51.23 51.3,52.1 50,52.1 R9.1
N$21
  Top 0.254: U$4.2 49.58,49.03 49.25,49.35 R10.1
N$22  (1 unrouted)
N$23  (3 unrouted)
N$24
  pour Top (no thermals): 40.3,33 41.4,33 42.1,33.7 43.1,33.7 43.1,32.7 40.3,32.7
N$25
  Top 0.305: U1.3 37,53.6 36.3,54.3 U$1.1
N$28
  pour Top (rank 2, no thermals): 40.3,32.4 41.4,32.4 41.5,32.3 43.1,32.3 43.1,31.1 41.2,31.1 40.3,32
N$39  (1 unrouted)
N$40  (1 unrouted)
N$41  (1 unrouted)
N$43
  Top 0.406: R29.2 48.4,30.95 U$2.1
N$44
  Top 0.406: R29.1 48.65,33.2 LED5.C
N$45
  pour Top (rank 2, no thermals): 36.2,33 38.1,33 39.7,31.4 39.7,27.6 39.6,27.5 38.5,27.5 38.4,27.6 38.4,31.5 37.3,32.6 36.2,32.6
N$46  (1 unrouted)
  pour Top (no thermals): 34.2,34.1 34.3,34.2 35.6,34.2 36.2,33.6 37.3,33.6 37.3,33.3 36.1,33.3 35.7,32.9 34.3,32.9 34.2,33
PWR_OFF
  Top 0.254: U1.8 37.3,51.1 36.9,50.7 36.9,49.9 36.1,49.1 34.9,47.9 34.9,41.7 33.6,40.5 R6.2
PWR_ON  (2 unrouted)
PWR_ON_µC  (via drill 0.5)  (1 unrouted)
  Top 0.254: U1.17 42,49.2 43.3,47.9 45.7,47.9 | 45.7,47.9 46.1,47.9 | 46.1,47.9 46.35,47.9 R28.2 47.3,38 44.9,35.6 | v45.9,47.1 45.9,47.7 | 45.9,47.7 45.7,47.9 | 45.7,47.9 46.1,47.9 | 46.1,47.9 45.9,47.7
RESET1
  Top 0.254: U1.4 36.8,53.1 36.5,53.4 32,53.4 31.3,53.4 30.9,53 C9.2
SPI1_CS
  Top 0.254: R5.1 37.3,46.3 39,48 U1.11
SPI1_MISO
  Top 0.254: U1.13 40,47.2 39.4,46.6 R3.1
SPI1_MOSI
  Top 0.254: 43.7,46 43,46.7 41,46.7 40.5,47.2 U1.14
  Top 0.406: R1.1 43.7,46
SPI1_SCK
  Top 0.254: 41.35,45.75 40.5,44.9 38.8,44.9 38.4,45.3 38.4,46.5 39.5,47.6 U1.12
  Top 0.406: R4.1 41.35,45.75
SWCLK  (via drill 0.5)
  Top 0.254: U1.28 42.5,55.7 42.8,56 v43.2,56
  Bottom 0.254: v43.2,56 SWCLK.PP
SWDIO  (via drill 0.5)
  Top 0.254: v46.7,54.6 46.7,53.5 46.2,53 44.3,53 44,53.3 43.7,53.6 43.3,53.6 U1.25
  Bottom 0.254: SWDIO.PP 46.7,55.3 v46.7,54.6
USART1_RX
  Top 0.254: U1.22 46.65,52.1 46.7,52.1 R9.2
USART1_TX
  Top 0.254: U1.21 46.65,51.6 46.7,51.6 47.45,50.85 R10.2
USART2_RX  (via drill 0.5)
  Top 0.254: U1.10 38.23,49.83 36.9,48.5 v36.9,47.8
  Bottom 0.254: v36.9,47.8 36.9,50.15 R22.1
USART2_TX  (via drill 0.5)
  Top 0.254: U1.9 37.5,50.6 37.4,50.5 37.4,49.7 36.5,48.8 35.8,48.1 v35.8,47.6
  Bottom 0.254: R23.1 35.8,48.65 v35.8,47.6
VBUS
  Top 0.254: U$4.10 56.08,48.38 56.5,47.95 C16.1 57.6,45.45 57.6,39.7 57.1,39.2 X2.VBUS
  Top 0.4: 51.7,36.9 51.7,35.4
  Top 0.406: C6.2 53.25,27.85 53.8,28.4 53.8,31.15 53.8,32.6 52.9,33.5 52.8,33.6 | 51.7,36.9 51.7,37.1 51.9,37.3 53.9,37.3 55.8,39.2 X2.VBUS | 52.8,33.6 52.7,33.7 | 52.7,33.7 52.55,33.85 52.45,33.95 | 52.45,33.95 52.2,34.2 | 52.2,34.2 52,34.4 51.7,34.7 51.7,35.4 | 52.8,33.6 52.7,33.7 | LED5.A 51.75,33.25 52.2,33.7 | 52.2,33.7 52.45,33.95 | 52.2,34.2 52.2,33.7 | 52.7,33.7 52.2,33.7
  Top 0.61: U$2.4 C6.2
VCC  (via drill 0.5)  (10 unrouted)
  Top 0.254: U$10.1 37.1,24.17 37.1,23
  Top 0.305: U1.1 37.73,56.43 C7.1 | C11.1 36.85,52.1 U1.6 | U1.19 44.85,50.6 C3.1 45.55,50.55 46.6,49.5 48.1,49.5 | 36.85,59.3 36.85,60.35 38.4,61.9 BOOTMD.1 | U$3.13 39.25,37.4 C1.1 | 48.4,50 48.4,54.1 46.95,55.55 C5.1 43.95,54.6 U1.27 | 48.1,49.5 48.4,49.5 | 48.1,49.5 48.3,49.7 | 48.1,49.5 48.4,49.2
  Top 0.4: v32.3,50.8 32.3,38
  Top 0.406: C7.1 36.85,59.3 C2.1 v35.6,59.4 | C11.1 C10.1 33.35,50.8 v32.3,50.8 | 40.2,35 45.1,35 48.4,38.3 48.4,49.2 48.4,49.5 48.4,50
  Bottom 0.254: 50.15,46.37 U$5.P$12 U$5.P$11
  Bottom 0.406: v32.3,50.8 31.4,51.7 31.4,55.5 35.3,59.4 v35.6,59.4
VCCIO  (via drill 0.5)
  Top 0.254: C19.1 53.48,46.08 U$4.8 | U$4.9 54.45,45.6 C19.1 | C19.1 55.3,46.45 v55.3,46.8 | U$4.1 50.5,49.73 v50.5,50.5 | LED1.A LED2.A 57.35,37.25 v58.8,38.7
  Bottom 0.254: 51.3,50.5 52.6,50.5 52.7,50.5 55.3,47.9 v55.3,46.8 57.6,46.8 59.5,44.9 59.5,39.4 v58.8,38.7 | 51.3,50.5 v50.5,50.5 51.3,50.5
VOLTAGE
  Top 0.254: U1.7 37.1,51.6 36.4,50.9 36.4,50.1 35.3,49 34.1,47.8 34.1,45.85 C20.1 33.15,45.4 R12.1 R21.2

### Text on the board
Dimension: usable board space in freeware | BLDC